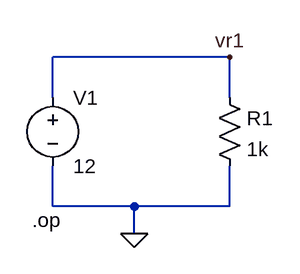
[diagram p0: schematic aula1.7.asc]
aula1.7.asc, the LTspice schematic file:
Version 4
SHEET 1 880 680
WIRE 208 80 0 80
WIRE 0 128 0 80
WIRE 208 128 208 80
WIRE 0 256 0 208
WIRE 96 256 0 256
WIRE 208 256 208 208
WIRE 208 256 96 256
WIRE 96 288 96 256
FLAG 96 288 0
FLAG 208 80 vr1
SYMBOL voltage 0 112 R0
SYMATTR InstName V1
SYMATTR Value 12
SYMBOL res 192 112 R0
SYMATTR InstName R1
SYMATTR Value 1k
TEXT -24 272 Left 2 !.op

The netlist it stands for:
* aula1.7.asc
V1 vr1 0 12
R1 vr1 0 1k
.op
.backanno
.end